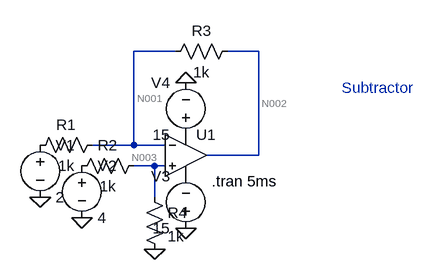
[diagram p0: schematic subtractor.asc]
subtractor.asc, the LTspice schematic file:
Version 4
SHEET 1 880 680
WIRE 192 0 128 0
WIRE 320 0 272 0
WIRE 128 144 128 0
WIRE 128 144 64 144
WIRE 176 144 128 144
WIRE 320 160 320 0
WIRE 320 160 240 160
WIRE 160 176 128 176
WIRE 176 176 160 176
WIRE 160 224 160 176
FLAG -16 224 0
FLAG 48 256 0
FLAG 160 304 0
FLAG 208 272 0
FLAG 208 48 0
SYMBOL Opamps\\UniversalOpamp2 208 160 R0
SYMATTR InstName U1
SYMBOL res 80 128 R90
WINDOW 0 0 56 VBottom 2
WINDOW 3 32 56 VTop 2
SYMATTR InstName R1
SYMATTR Value 1k
SYMBOL res 144 160 R90
WINDOW 0 0 56 VBottom 2
WINDOW 3 32 56 VTop 2
SYMATTR InstName R2
SYMATTR Value 1k
SYMBOL res 288 -16 R90
WINDOW 0 0 56 VBottom 2
WINDOW 3 32 56 VTop 2
SYMATTR InstName R3
SYMATTR Value 1k
SYMBOL res 144 208 R0
SYMATTR InstName R4
SYMATTR Value 1k
SYMBOL voltage -16 128 R0
WINDOW 123 0 0 Left 0
WINDOW 39 0 0 Left 0
SYMATTR InstName V1
SYMATTR Value 2
SYMBOL voltage 48 160 R0
WINDOW 123 0 0 Left 0
WINDOW 39 0 0 Left 0
SYMATTR InstName V2
SYMATTR Value 4
SYMBOL voltage 208 288 R180
WINDOW 0 24 96 Left 2
WINDOW 3 24 16 Left 2
WINDOW 123 0 0 Left 0
WINDOW 39 0 0 Left 0
SYMATTR InstName V3
SYMATTR Value 15
SYMBOL voltage 208 144 R180
WINDOW 0 24 96 Left 2
WINDOW 3 24 16 Left 2
WINDOW 123 0 0 Left 0
WINDOW 39 0 0 Left 0
SYMATTR InstName V4
SYMATTR Value 15
TEXT 248 200 Left 2 !.tran 5ms
TEXT 448 56 Left 2 ;Subtractor

The netlist it stands for:
* subtractor.asc
XU1 N003 N001 P001 P002 N002 level.2 Avol=1Meg GBW=10Meg Slew=10Meg ilimit=25m rail=0 Vos=0 phimargin=45 en=0 enk=0 in=0 ink=0 Rin=500Meg  ; pins IN+ IN- V+ V- OUT
R1 N001 P003 1k
R2 N003 P004 1k
R3 N002 N001 1k
R4 N003 0 1k
V1 P003 0 2
V2 P004 0 4
V3 0 P002 15
V4 P001 0 15
.tran 5ms
* Subtractor
.lib UniversalOpamps2.sub
.backanno
.end

* Results of the author's LTspice run, read from the files saved beside the schematic
* Operating Point, zero values left out:
*   V(n002) = 2 V
*   V(p001) = 15 V
*   V(p002) = -15 V
*   V(n001) = 2 V
*   V(n003) = 2 V
*   V(p003) = 2 V
*   V(p004) = 4 V
*   I(R4) = 2 mA
*   I(R3) = -3.253 pA
*   I(R2) = -2 mA
*   I(R1) = -4.003 nA
*   I(V4) = -1.485 mA
*   I(V3) = -1.485 mA
*   I(V2) = -2 mA
*   I(V1) = -4.003 nA
*   Ix(u1:1) = 4 nA
*   Ix(u1:2) = 4 nA
*   Ix(u1:3) = 1.485 mA
*   Ix(u1:4) = -1.485 mA
*   Ix(u1:5) = 3.253 pA